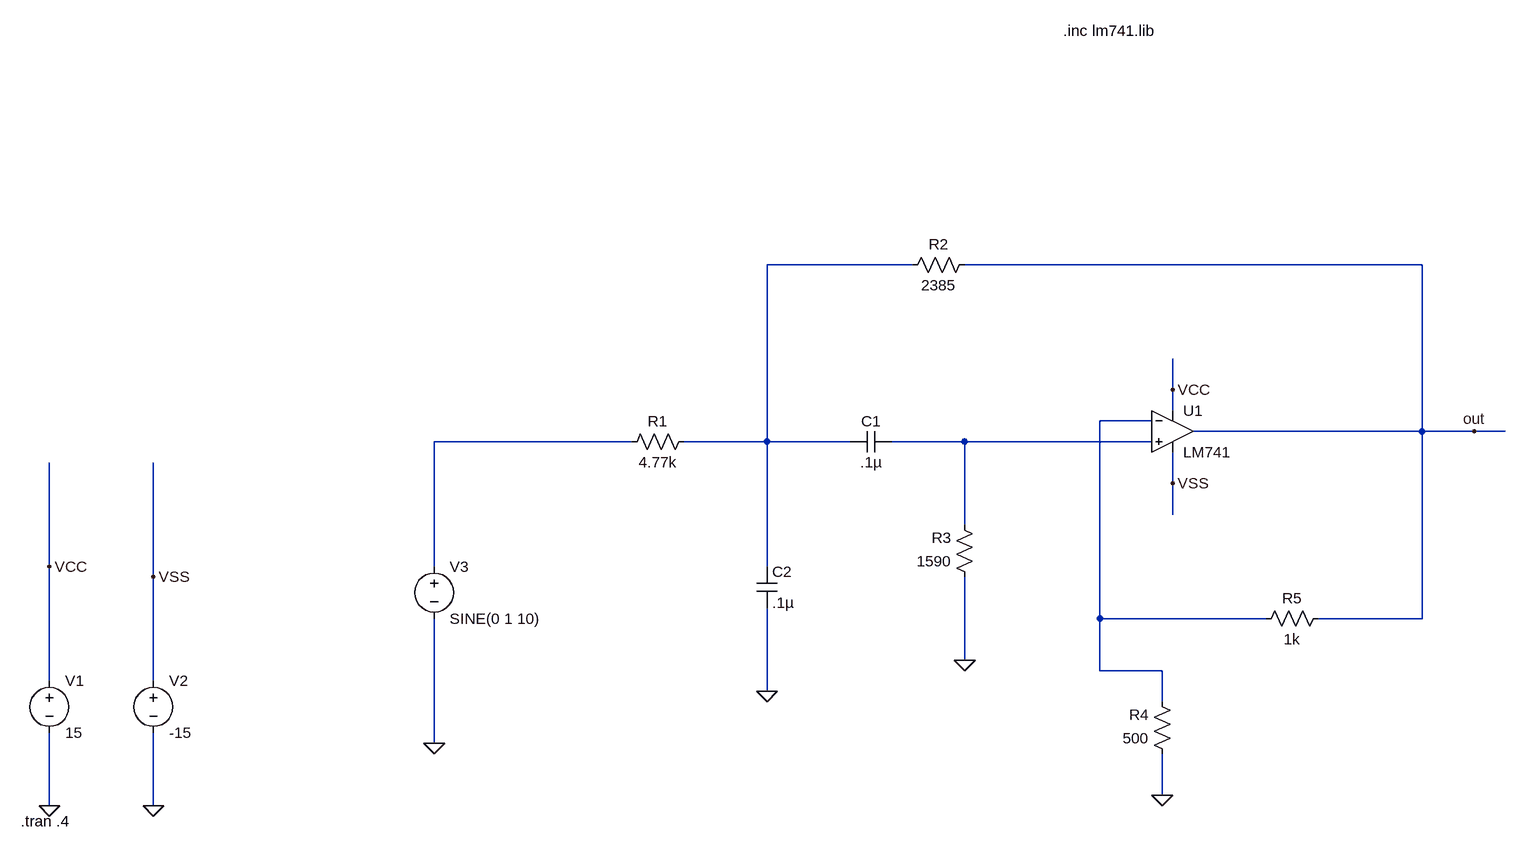
[diagram p0: schematic ActiveBPF.asc]
ActiveBPF.asc, the LTspice schematic file:
Version 4
SHEET 1 1684 680
WIRE 768 -224 544 -224
WIRE 1552 -224 848 -224
WIRE 1168 -32 1168 -80
WIRE 1168 0 1168 -32
WIRE 1136 16 1056 16
WIRE 1552 32 1552 -224
WIRE 1552 32 1200 32
WIRE 1632 32 1552 32
WIRE 1680 32 1632 32
WIRE 336 48 32 48
WIRE 544 48 544 -224
WIRE 544 48 416 48
WIRE 672 48 544 48
WIRE 848 48 736 48
WIRE 1136 48 848 48
WIRE 1168 112 1168 64
WIRE 1168 160 1168 112
WIRE 848 176 848 48
WIRE -560 240 -560 80
WIRE 32 240 32 48
WIRE 544 240 544 48
WIRE -400 256 -400 80
WIRE 1056 320 1056 16
WIRE 1312 320 1056 320
WIRE 1552 320 1552 32
WIRE 1552 320 1392 320
WIRE 848 384 848 256
WIRE 1056 400 1056 320
WIRE 1152 400 1056 400
WIRE -560 416 -560 240
WIRE -400 416 -400 256
WIRE 544 432 544 304
WIRE 1152 448 1152 400
WIRE 32 512 32 320
WIRE 1152 592 1152 528
WIRE -560 608 -560 496
WIRE -400 608 -400 496
FLAG -560 608 0
FLAG -400 608 0
FLAG 32 512 0
FLAG 544 432 0
FLAG 848 384 0
FLAG 1152 592 0
FLAG 1168 112 VSS
FLAG -400 256 VSS
FLAG -560 240 VCC
FLAG 1168 -32 VCC
FLAG 1632 32 out
SYMBOL voltage -560 400 R0
SYMATTR InstName V1
SYMATTR Value 15
SYMBOL voltage -400 400 R0
SYMATTR InstName V2
SYMATTR Value -15
SYMBOL voltage 32 224 R0
WINDOW 123 0 0 Left 0
WINDOW 39 0 0 Left 0
SYMATTR InstName V3
SYMATTR Value SINE(0 1 10)
SYMBOL res 432 32 R90
WINDOW 0 0 56 VBottom 2
WINDOW 3 32 56 VTop 2
SYMATTR InstName R1
SYMATTR Value 4.77k
SYMBOL res 864 -240 R90
WINDOW 0 0 56 VBottom 2
WINDOW 3 32 56 VTop 2
SYMATTR InstName R2
SYMATTR Value 2385
SYMBOL res 864 272 R180
WINDOW 0 36 76 Left 2
WINDOW 3 36 40 Left 2
SYMATTR InstName R3
SYMATTR Value 1590
SYMBOL res 1168 544 R180
WINDOW 0 36 76 Left 2
WINDOW 3 36 40 Left 2
SYMATTR InstName R4
SYMATTR Value 500
SYMBOL res 1296 336 R270
WINDOW 0 32 56 VTop 2
WINDOW 3 0 56 VBottom 2
SYMATTR InstName R5
SYMATTR Value 1k
SYMBOL cap 736 32 R90
WINDOW 0 0 32 VBottom 2
WINDOW 3 32 32 VTop 2
SYMATTR InstName C1
SYMATTR Value .1µ
SYMBOL cap 528 240 R0
SYMATTR InstName C2
SYMATTR Value .1µ
SYMBOL OpAmps\\UniversalOpAmp 1168 32 R0
SYMATTR InstName U1
SYMATTR SpiceModel ""
SYMATTR Prefix LM714
SYMATTR Value2 ""
SYMATTR SpiceLine ""
SYMATTR Value LM741
TEXT 1000 -584 Left 2 !.inc lm741.lib
TEXT -604 632 Left 2 !.tran .4

The netlist it stands for:
* ActiveBPF.asc
V1 VCC 0 15
V2 VSS 0 -15
V3 N003 0 SINE(0 1 10)
R1 N001 N003 4.77k
R2 out N001 2385
R3 0 N004 1590
R4 0 N002 500
R5 N002 out 1k
C1 N004 N001 .1µ
C2 N001 0 .1µ
L§U1 N004 N002 VCC VSS out LM741
.inc lm741.lib
.tran .4
.lib UniversalOpAmp1.lib
.backanno
.end